# EAGLE schematic ts7_redraw (EAGLE 8.5.1)
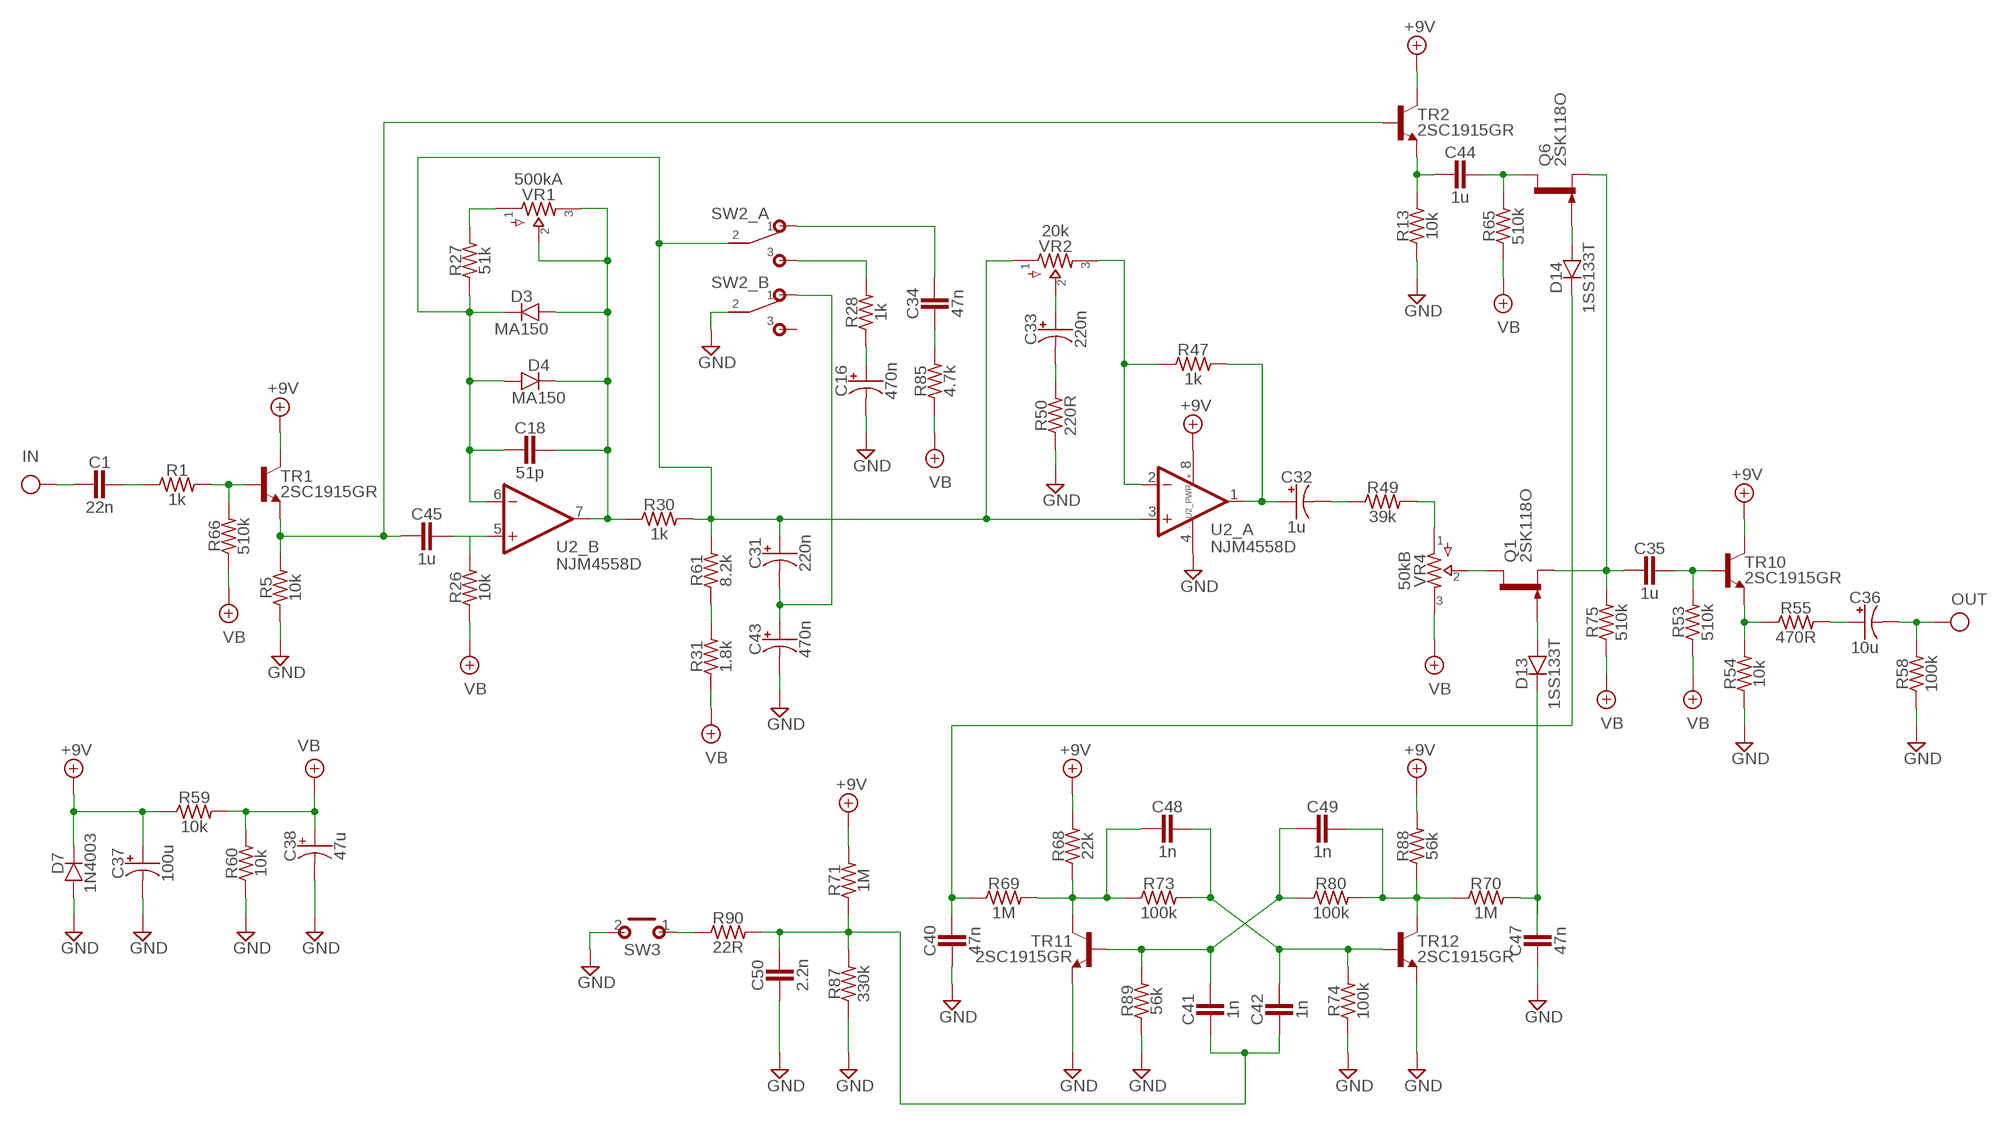
[diagram p0: schematic, sheet 1]

## Parts
C1  22n  CER/FILMBOX.1  [BOX_SMALL]
C16  470n  0400  [040_020]
C18  51p  CER/FILMBOX.1  [BOX_SMALL]
C31  220n  0400  [040_020]
C32  1u  0400  [040_020]
C33  220n  0400  [040_020]
C34  47n  CER/FILMBOX.1  [BOX_SMALL]
C35  1u  CER/FILMBOX.1  [BOX_SMALL]
C36  10u  0400  [040_020]
C37  100u  0400  [040_020]
C38  47u  0400  [040_020]
C40  47n  CER/FILMBOX.1  [BOX_SMALL]
C41  1n  CER/FILMBOX.1  [BOX_SMALL]
C42  1n  CER/FILMBOX.1  [BOX_SMALL]
C43  470n  0400  [040_020]
C44  1u  CER/FILMBOX.1  [BOX_SMALL]
C45  1u  CER/FILMBOX.1  [BOX_SMALL]
C47  47n  CER/FILMBOX.1  [BOX_SMALL]
C48  1n  CER/FILMBOX.1  [BOX_SMALL]
C49  1n  CER/FILMBOX.1  [BOX_SMALL]
C50  2.2n  CER/FILMBOX.1  [BOX_SMALL]
D3  MA150  DO41.2  [DO41-2]
D4  MA150  DO41.2  [DO41-2]
D7  1N4003  DO41.2  [DO41-2]
D13  1SS133T  DO41.2  [DO41-2]
D14  1SS133T  DO41.2  [DO41-2]
Q1  2SK118O  2N5457  [TO92-]
Q6  2SK118O  2N5457  [TO92-]
R1  1k  R_.3B  [R0207/3]
R5  10k  R_.3B  [R0207/3]
R13  10k  R_.3B  [R0207/3]
R26  10k  R_.3B  [R0207/3]
R27  51k  R_.3B  [R0207/3]
R28  1k  R_.3B  [R0207/3]
R30  1k  R_.3B  [R0207/3]
R31  1.8k  R_.3B  [R0207/3]
R47  1k  R_.3B  [R0207/3]
R49  39k  R_.3B  [R0207/3]
R50  220R  R_.3B  [R0207/3]
R53  510k  R_.3B  [R0207/3]
R54  10k  R_.3B  [R0207/3]
R55  470R  R_.3B  [R0207/3]
R58  100k  R_.3B  [R0207/3]
R59  10k  R_.3B  [R0207/3]
R60  10k  R_.3B  [R0207/3]
R61  8.2k  R_.3B  [R0207/3]
R65  510k  R_.3B  [R0207/3]
R66  510k  R_.3B  [R0207/3]
R68  22k  R_.3B  [R0207/3]
R69  1M  R_.3B  [R0207/3]
R70  1M  R_.3B  [R0207/3]
R71  1M  R_.3B  [R0207/3]
R73  100k  R_.3B  [R0207/3]
R74  100k  R_.3B  [R0207/3]
R75  510k  R_.3B  [R0207/3]
R80  100k  R_.3B  [R0207/3]
R85  4.7k  R_.3B  [R0207/3]
R87  330k  R_.3B  [R0207/3]
R88  56k  R_.3B  [R0207/3]
R89  56k  R_.3B  [R0207/3]
R90  22R  R_.3B  [R0207/3]
SW2  DPDT  [DPDT]
SW3  MOMENTARY  [SPST]
TR1  2SC1915GR  2SC828A  [TO92-]
TR2  2SC1915GR  2SC828A  [TO92-]
TR10  2SC1915GR  2SC828A  [TO92-]
TR11  2SC1915GR  2SC828A  [TO92-]
TR12  2SC1915GR  2SC828A  [TO92-]
U2  NJM4558D  DUALTH  [DIL0]
VR1  500kA  POTS16MM  [16MM]
VR2  20k  POTS16MM  [16MM]
VR4  50kB  POTS16MM  [16MM]

## Nets
+9V: C37.+ D7.C R59.1 R68.2 R71.2 R88.2 TR1.2(C) TR2.2(C) TR10.2(C) U2.8(_PWR:V+)
GND: C16.- C37.- C38.- C40.2 C43.- C47.2 C50.2 D7.A R5.1 R13.1 R50.1 R54.1 R58.1 R60.1 R74.1 R87.1 R89.1 SW2.B2 SW3.2(S) TR11.3(E) TR12.3(E) U2.4(_PWR:V-)
IN: C1.2
N$1: C1.1 R1.1
N$2: R1.2 R66.2 TR1.1(B)
N$3: C45.2 R5.2 TR1.3(E) TR2.1(B)
N$4: C40.1 D14.C R69.1
N$6: C45.1 R26.2 U2.5(_B:+IN)
N$7: C18.2 C31.+ D3.C D4.A R27.1 R30.2 R61.2 SW2.A2 U2.3(_A:+IN) U2.6(_B:-IN) VR2.1
N$8: C18.1 D3.A D4.C R30.1 U2.7(_B:OUT) VR1.2 VR1.3
N$9: C34.1 SW2.A1
N$10: R31.2 R61.1
N$11: R27.2 VR1.1
N$12: C31.- C43.+ SW2.B1
N$13: R28.2 SW2.A3
N$14: C16.+ R28.1
N$15: C34.2 R85.2
N$16: R47.1 U2.2(_A:-IN) VR2.3
N$17: C32.+ R47.2 U2.1(_A:OUT)
N$18: C33.+ VR2.2
N$19: C33.- R50.2
N$29: C48.2 R68.1 R69.2 R73.1 TR11.2(C)
N$31: C49.1 R70.1 R80.2 R88.1 TR12.2(C)
N$32: C41.1 C49.2 R80.1 R89.2 TR11.1(B)
N$34: C42.1 C48.1 R73.2 R74.2 TR12.1(B)
N$36: C41.2 C42.2 C50.1 R71.1 R87.2 R90.2
N$38: R90.1 SW3.1(P)
N$44: C32.- R49.1
N$46: R49.2 VR4.1
N$47: C44.2 R13.2 TR2.3(E)
N$48: C44.1 Q6.3(D) R65.2
N$50: D14.A Q6.1(G)
N$51: C35.2 Q1.2(S) Q6.2(S) R75.2
N$52: Q1.3(D) VR4.2
N$53: D13.A Q1.1(G)
N$54: C35.1 R53.2 TR10.1(B)
N$55: R54.2 R55.1 TR10.3(E)
N$56: C36.+ R55.2
N$57: C47.1 D13.C R70.2
OUT: C36.- R58.2
VB: C38.+ R26.1 R31.1 R53.1 R59.2 R60.2 R65.1 R66.1 R75.1 R85.1 VR4.3
Unconnected: SW2.B3

## Library data of the parts
C1 C18 C34 C35 C40-C42 C44 C45 C47-C50 = pedals-capacitors-film:CER/FILM: 47 - 120pF Xicon Ceramic Disc 2.5mm lead spacing
C16 C31-C33 C36-C38 C43 = pedals-capacitors-elec:040
D3 D4 D7 D13 D14 = pedals-diodes:DO41: DO-41 Package Diodes: 1N4001 - 1N40019 Zener Diodes: 1N4728 - 1N4764
Q1 Q6 = pedals-transistors:2N5457: N-CHANNEL JFET
R1 R5 R13 R26-R28 R30 R31 R47 R49 R50 R53-R55 R58-R61 R65 R66 R68-R71 R73-R75 R80 R85 R87-R90 = pedals-resistors:R_
SW2 = pedals-switches:DPDT
SW3 = pedals-switches:MOMENTARY
TR1 TR2 TR10-TR12 = pedals-transistors:2SC828A
U2 = pedals-integrated circuits:DUAL: OP AMP
VR1 VR2 VR4 = pedals-potentiometers:POTS